# EAGLE schematic Adapter-MiniStamps-002 (EAGLE 7.3.0)
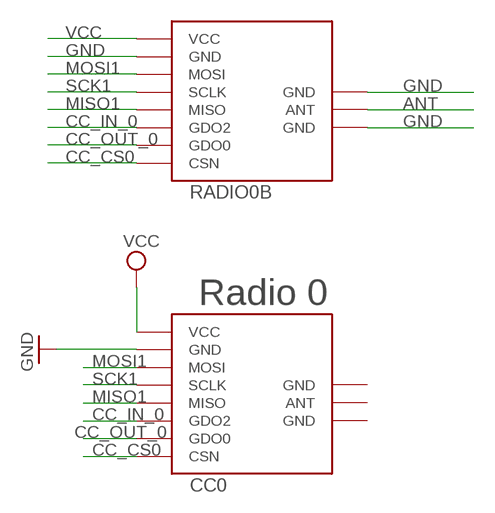
[diagram p0: schematic, sheet 1]

## Parts
CC0  CC1101_MODULE1SMD  [CC1101_MODULE1_SMD]
RADIO0B  CC1101_MODULE1SMALL  [CC1101_MODULE1_SMD]

## Nets
ANT: RADIO0B.ANT
CC_CS0: CC0.CSN RADIO0B.CSN
CC_IN_0: CC0.GDO2 RADIO0B.GDO2
CC_OUT_0: CC0.GDO0 RADIO0B.GDO0
GND: CC0.GND@0(GND) RADIO0B.GND@0(GND) RADIO0B.GND@1(GND) RADIO0B.GND@2(GND)
MISO1: CC0.MISO RADIO0B.MISO
MOSI1: CC0.MOSI RADIO0B.MOSI
SCK1: CC0.SCLK RADIO0B.SCLK
VCC: CC0.VCC RADIO0B.VCC
Unconnected: CC0.ANT

## Notes on the sheet
- Radio 0

## Power pins joined to a net without a drawn wire
GND: CC0.GND@1(GND) CC0.GND@2(GND)

## Library data of the parts
CC0 = wireless:CC1101_MODULE1: CC1101 wireless module for 433/868 MHz (sold from Aliexpress). DIL version for mounting with pin header (and SMD soldering) and SMD only variant available.
RADIO0B = Martin-Communication:CC1101_MODULE1: CC1101 wireless module for 433/868 MHz (sold from Aliexpress). DIL version for mounting with pin header (and SMD soldering) and SMD only variant available.

## Net classes
0 default: width 0.406 mm
1 PWR: width 0.305 mm